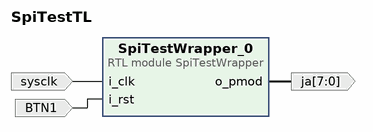
[diagram p0: block diagram of the top level]
# Vivado block design SpiTestTL, xc7z020clg400-1, Vivado 2021.1
create_bd_design SpiTestTL

create_bd_port -dir O -from 7 -to 0 ja
create_bd_port -dir I -type clk sysclk
set_property -dict {CONFIG.ASSOCIATED_RESET BTN1 CONFIG.FREQ_HZ 125000000} [get_bd_ports sysclk]
create_bd_port -dir I -type rst BTN1

create_bd_cell -type module -reference SpiTestWrapper SpiTestWrapper_0

# ---- connections ----

connect_bd_net [get_bd_pins SpiTestWrapper_0/o_pmod] [get_bd_ports ja]
connect_bd_net -net i_clk_0_1 [get_bd_ports sysclk] [get_bd_pins SpiTestWrapper_0/i_clk]
connect_bd_net -net i_rst_0_1 [get_bd_ports BTN1] [get_bd_pins SpiTestWrapper_0/i_rst]

validate_bd_design
save_bd_design
